# EAGLE design TapePower (EAGLE 6.6.0)
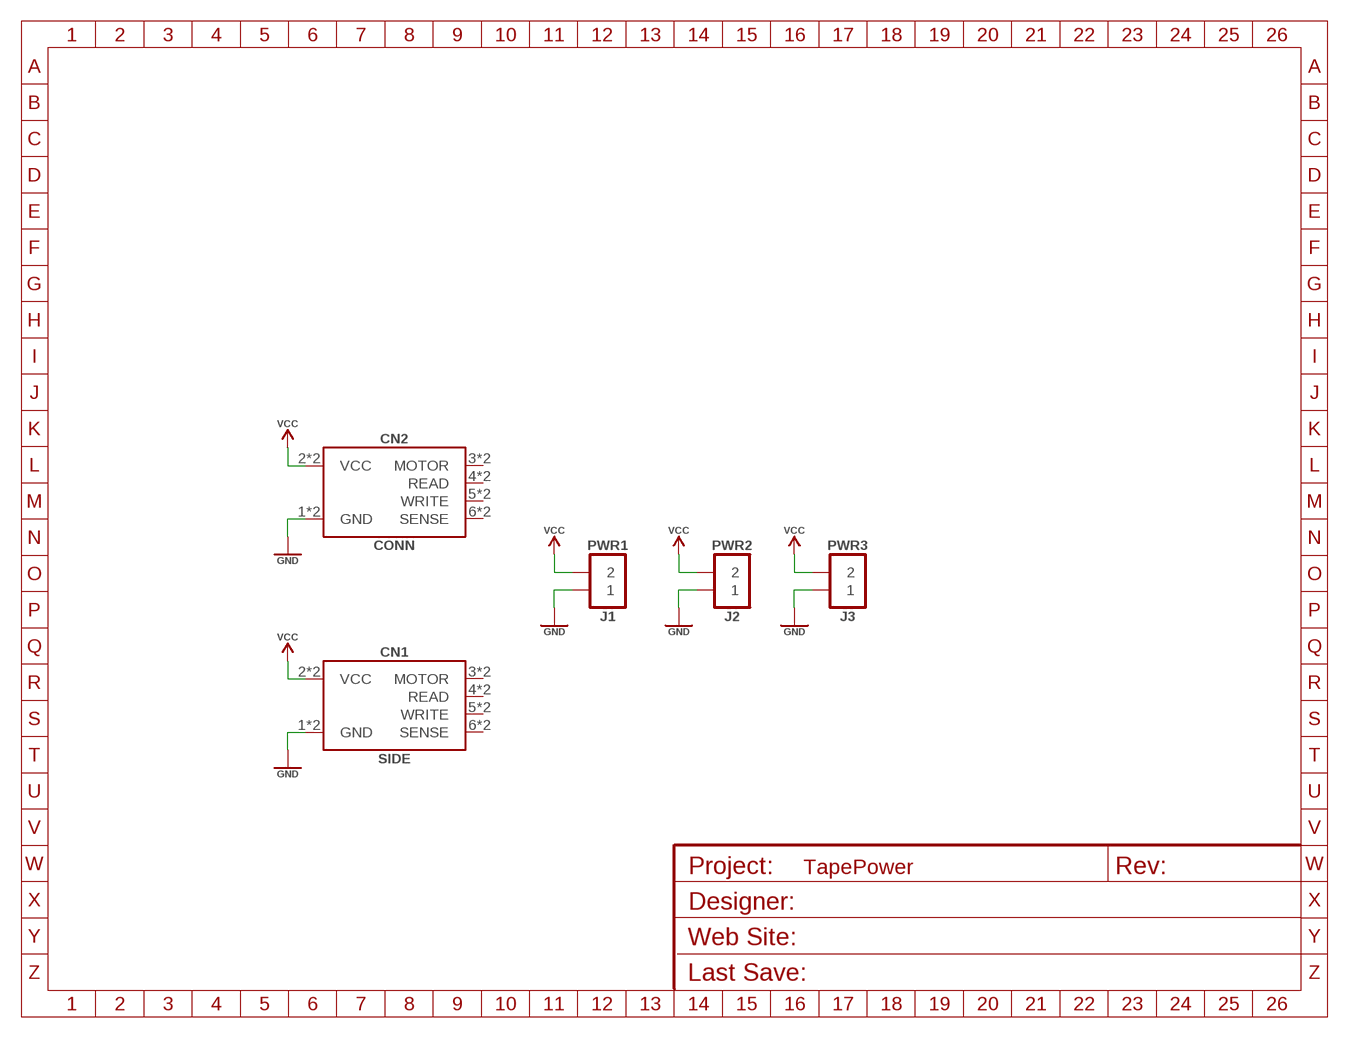
[diagram p0: schematic, sheet 1]
FRAME1 (A5L_FRAME): DESIGNER: Simon/CGTr; REVISION: 1.0; WEBSITE: http://www.commodore.gen.tr

## Parts
CN1  SIDE  C64_TAPE_SIDE  [C64_TAPE_SIDE]
CN2  CONN  C64_TAPE_PADS  [C64_TAPE_PADS]
J1  PWR1  HDR_1X02  [HDR_1X02]
J2  PWR2  HDR_1X02  [HDR_1X02]
J3  PWR3  HDR_1X02  [HDR_1X02]

## Nets
GND: CN1.1(GND) CN1.A(GND) CN2.1(GND) CN2.A(GND) J1.1 J2.1 J3.1
VCC: CN1.2(VCC) CN1.B(VCC) CN2.2(VCC) CN2.B(VCC) J1.2 J2.2 J3.2
Unconnected: CN1.3(MOTOR) CN1.4(READ) CN1.5(WRITE) CN1.6(SENSE) CN1.C(MOTOR) CN1.D(READ) CN1.E(WRITE) CN1.F(SENSE) CN2.3(MOTOR) CN2.4(READ) CN2.5(WRITE) CN2.6(SENSE) CN2.C(MOTOR) CN2.D(READ) CN2.E(WRITE) CN2.F(SENSE)

## Library data of the parts
CN1 CN2 = sj_commodore:C64_TAPE: C64 Tape Pads
J1-J3 = sj_connectors:HDR_1X02: 1x02 - 0.1" Pin Header

## Board
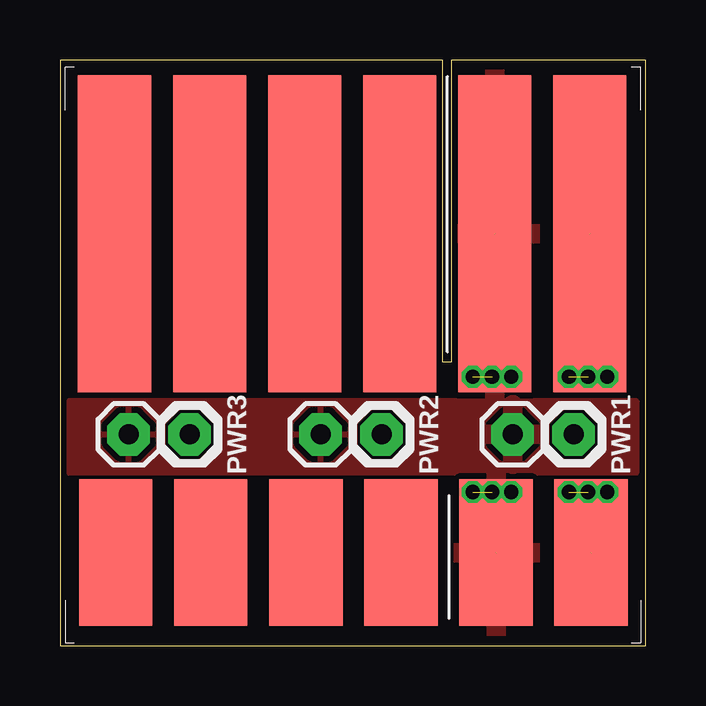
[diagram p1: board, top side]
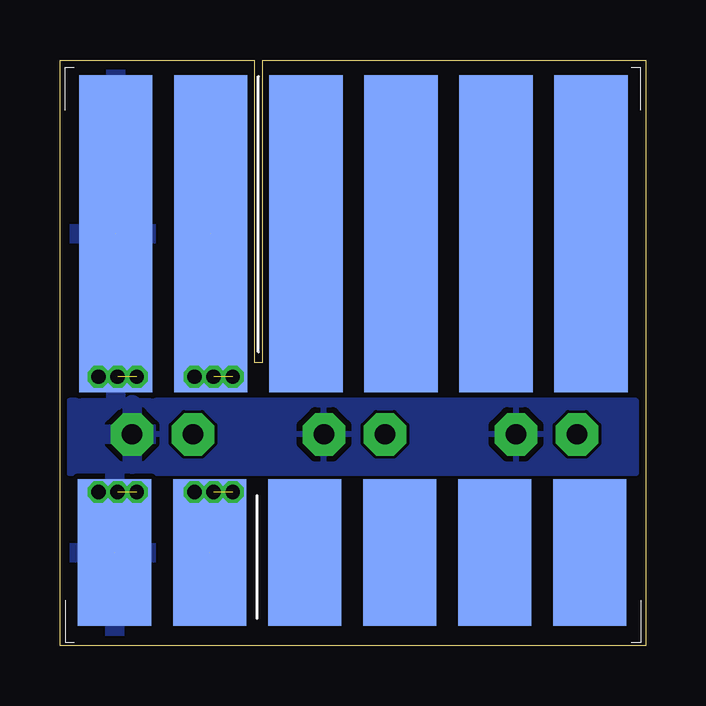
[diagram p2: board, bottom side, seen from below]

Size 24.4 x 24.4 mm. Coordinates in mm from the lower left corner, seen from the top.
Outline: 0,0 24.4,0 24.4,24.4 16.3,24.4 16.3,11.8 15.95,11.8 15.95,24.4 0,24.4 0,0
Copper layers (1*16): Top 0.035mm / dielectric 1.5mm / Bottom 0.035mm
Design rules "DirtyPCBs": minimum track width 5mil, minimum drill 12mil, track to track 5mil, track to pad 5mil, pad to pad 5mil, via to via 5mil, smd to smd 0mil, copper to edge 10mil, drill to drill 10mil, minimum pad ring 10mil, minimum via ring 6mil, stop-mask expansion 2mil, vias tented up to drill 25mil, thermal gap 10mil

### Footprints (pad centres in the part's own frame; a part is rotated, then mirrored left to right if it is on the bottom)
C64_TAPE_SIDE = smd 3.048 x 13.208: 1 -9.873,-1.241; 2 -5.913,-1.241; 3 -1.953,-1.241; 4 2.007,-1.241; 5 5.967,-1.241; 6 9.927,-1.241 | smd 3.048 x 13.208 bottom: A -9.873,-1.241; B -5.913,-1.241; C -1.953,-1.241; D 2.007,-1.241; E 5.967,-1.241; F 9.927,-1.241
C64_TAPE_PADS = smd 3.048 x 6.096: 1 9.927,-3.781; 2 5.967,-3.781; 3 2.007,-3.781; 4 -1.953,-3.781; 5 -5.913,-3.781; 6 -9.873,-3.781 | smd 3.048 x 6.096 bottom: A 9.927,-3.781; B 5.967,-3.781; C 2.007,-3.781; D -1.953,-3.781; E -5.913,-3.781; F -9.873,-3.781
HDR_1X02 = drill 0.838 pad 1.778 octagon: 1 0,0; 2 2.54,0

### Placement (x,y rotation side)
CN1  12.2,15.91 180 top
CN2  12.2,7.66 0 top
J1  21.4,8.8 180 top
J2  13.4,8.8 180 top
J3  5.4,8.8 180 top

### Tracks (layer width: path | path; a pad name or v marks a point on that pad's centre or on a via)
GND  (via drill 0.6)  (4 unrouted)
  other vias: 21.2,11.2 22,11.2 22.8,11.2 21.2,6.4 22,6.4 22.8,6.4
  pour Bottom: 0.4,10.2 24,10.2 24,7.2 0.4,7.2
  pour Bottom: 20.8,23.6 23.6,23.6 23.6,0.8 20.8,0.8
VCC  (via drill 0.6)  (4 unrouted)
  other vias: 17.2,11.2 18,11.2 18.8,11.2 17.2,6.4 18,6.4 18.8,6.4
  pour Top: 0.4,10.2 24,10.2 24,7.2 0.4,7.2
  pour Top: 16.8,23.6 19.6,23.6 19.6,0.8 16.8,0.8